# Altium schematic sheet Serial.SchDoc
size A4
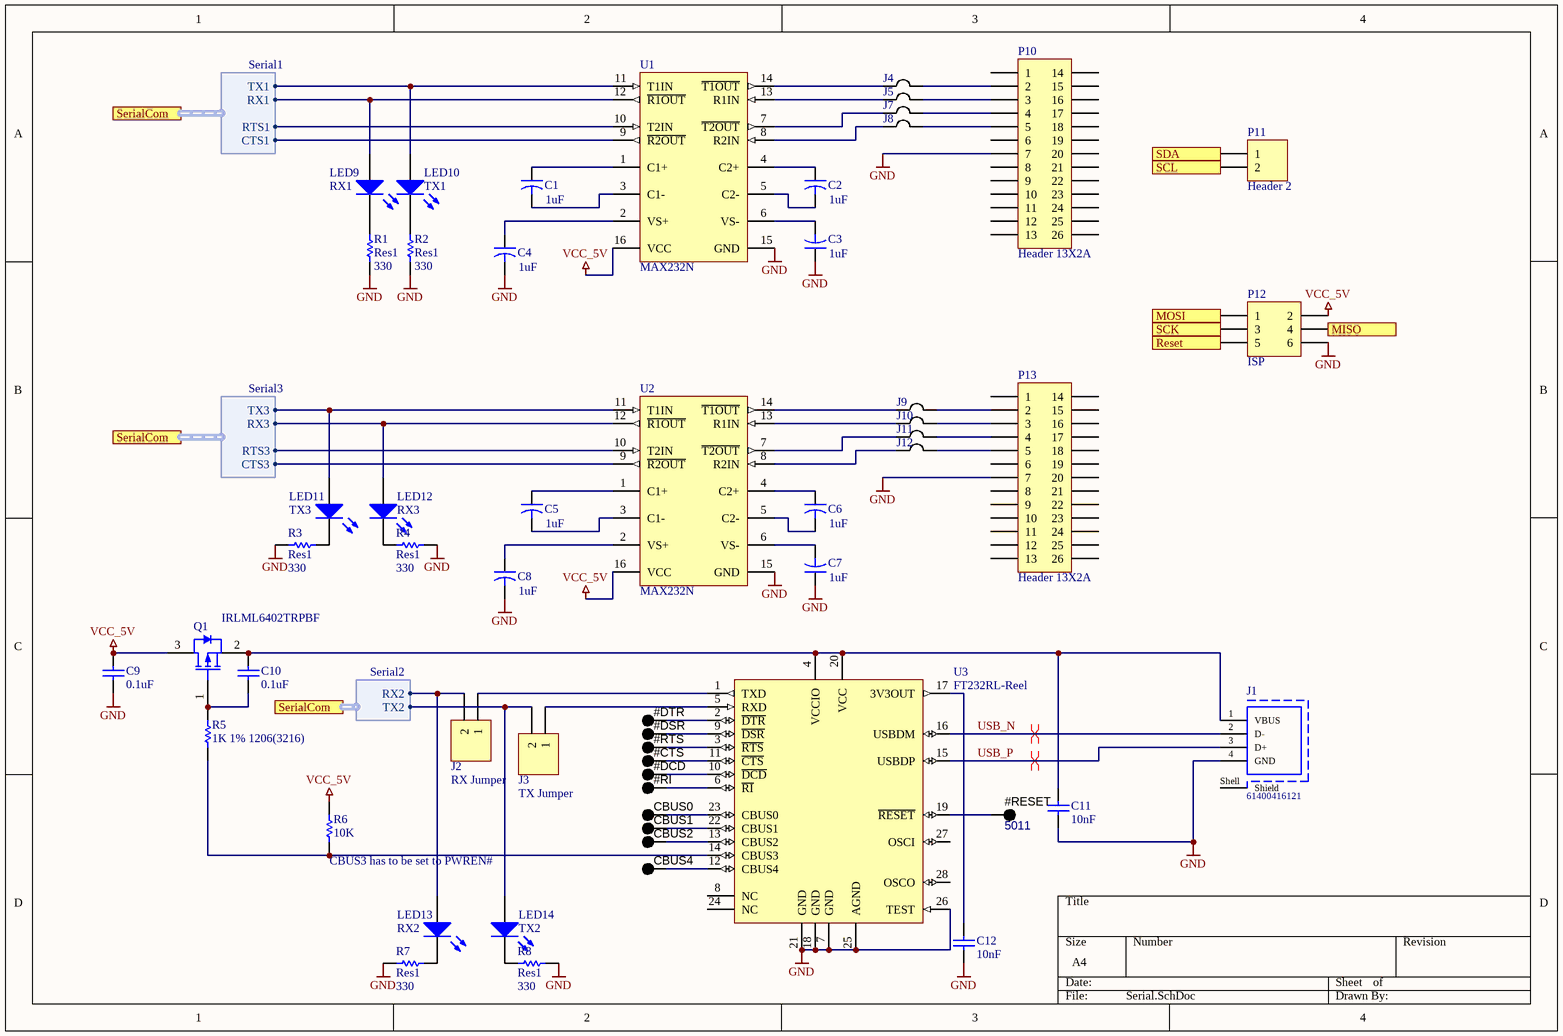
[diagram p0: Serial.SchDoc]

## Parts
#CTS  5011  [KSTN-5011_V]  (value not drawn)
#DCD  5011  [KSTN-5011_V]  (value not drawn)
#DSR  5011  [KSTN-5011_V]  (value not drawn)
#DTR  5011  [KSTN-5011_V]  (value not drawn)
#RESET  5011  [KSTN-5011_V]
#RI  5011  [KSTN-5011_V]  (value not drawn)
#RTS  5011  [KSTN-5011_V]  (value not drawn)
C1  value 1uF  [CAPR5-4X5]  (hidden comment: Cap2)
C2  value 1uF  [CAPR5-4X5]  (hidden comment: Cap2)
C3  value 1uF  [CAPR5-4X5]  (hidden comment: Cap2)
C4  value 1uF  [CAPR5-4X5]  (hidden comment: Cap2)
C5  value 1uF  [CAPR5-4X5]  (hidden comment: Cap2)
C6  value 1uF  [CAPR5-4X5]  (hidden comment: Cap2)
C7  value 1uF  [CAPR5-4X5]  (hidden comment: Cap2)
C8  value 1uF  [CAPR5-4X5]  (hidden comment: Cap2)
C9  0.1uF  [CAPC1206(3216)130_L]
C10  0.1uF  [CAPC1206(3216)130_L]
C11  10nF  [CAPC1206(3216)130_M]
C12  10nF  [CAPC1206(3216)130_M]
CBUS0  5011  [KSTN-5011_V]  (value not drawn)
CBUS1  5011  [KSTN-5011_V]  (value not drawn)
CBUS2  5011  [KSTN-5011_V]  (value not drawn)
CBUS4  5011  [KSTN-5011_V]  (value not drawn)
J1  61400416121  [61400416121]
J2  RX Jumper  [HDR1X2]
J3  TX Jumper  [HDR1X2]
J4  Jumper  [SMDJumper]  (value not drawn)
J5  Jumper  [SMDJumper]  (value not drawn)
J7  Jumper  [SMDJumper]  (value not drawn)
J8  Jumper  [SMDJumper]  (value not drawn)
J9  Jumper  [SMDJumper]  (value not drawn)
J10  Jumper  [SMDJumper]  (value not drawn)
J11  Jumper  [SMDJumper]  (value not drawn)
J12  Jumper  [SMDJumper]  (value not drawn)
LED9  RX1  [Type 3mm]
LED10  TX1  [Type 3mm]
LED11  TX3  [Type 3mm]
LED12  RX3  [Type 3mm]
LED13  RX2  [Type 3mm]
LED14  TX2  [Type 3mm]
P10  Header 13X2A  [HDR2X13_CEN]
P11  Header 2  [HDR1X2]
P12  ISP  [HDR2X3]
P13  Header 13X2A  [HDR2X13_CEN]
Q1  IRLML6402TRPBF  [INTR-SOT-23-3_V]
R1  Res1  value 330  [AXIAL-0.3]
R2  Res1  value 330  [AXIAL-0.3]
R3  Res1  value 330  [AXIAL-0.3]
R4  Res1  value 330  [AXIAL-0.3]
R5  1K 1% 1206(3216)  [RESC1206(3216)_N]
R6  10K  [RESC1206(3216)_M]
R7  Res1  value 330  [AXIAL-0.3]
R8  Res1  value 330  [AXIAL-0.3]
U1  MAX232N  [N0016A]
U2  MAX232N  [N0016A]
U3  FT232RL-Reel  [SSOP-28_M]

## Ports
MISO, MOSI, Reset, SCK, SCL, SDA, SerialCom (harness Serial1), SerialCom (harness Serial2), SerialCom (harness Serial3)

## Harnesses
Serial1: TX1, RX1, CTS1, RTS1
Serial2: TX2, RX2
Serial3: TX3, RX3, CTS3, RTS3

## Nets
GND: C3.1 C4.2 C7.1 C8.2 C9.2 C11.1 C12.1 J1.4(GND) P10.7 P12.6 P13.7 R1.1 R2.1 R3.1 R4.2 R7.1 R8.2 U1.15(GND) U2.15(GND) U3.7(GND) U3.18(GND) U3.21(GND) U3.25(AGND) U3.26(TEST)
VCC_5V: C9.1 P12.2 Q1.3(DRAIN) R6.2 U1.16(VCC) U2.16(VCC)
MISO: P12.4 ; port MISO
MOSI: P12.1 ; port MOSI
Reset: P12.5 ; port Reset
SCK: P12.3 ; port SCK
SCL: P11.2 ; port SCL
SDA: P11.1 ; port SDA
USB_N: J1.2(D-) U3.16(USBDM)
USB_P: J1.3(D+) U3.15(USBDP)
Net#CTS_1: #CTS.1 U3.11(~{CTS})
Net#DCD_1: #DCD.1 U3.10(~{DCD})
Net#DSR_1: #DSR.1 U3.9(~{DSR})
Net#DTR_1: #DTR.1 U3.2(~{DTR})
Net#RESET_1: #RESET.1 U3.19(~{RESET})
Net#RI_1: #RI.1 U3.6(~{RI})
Net#RTS_1: #RTS.1 U3.3(~{RTS})
NetC1_1: C1.1 U1.1(C1+)
NetC1_2: C1.2 U1.3(C1-)
NetC2_1: C2.1 U1.4(C2+)
NetC2_2: C2.2 U1.5(C2-)
NetC3_2: C3.2 U1.6(VS-)
NetC4_1: C4.1 U1.2(VS+)
NetC5_1: C5.1 U2.1(C1+)
NetC5_2: C5.2 U2.3(C1-)
NetC6_1: C6.1 U2.4(C2+)
NetC6_2: C6.2 U2.5(C2-)
NetC7_2: C7.2 U2.6(VS-)
NetC8_1: C8.1 U2.2(VS+)
NetC10_1: C10.1 C11.2 J1.1(VBUS) Q1.2(SOURCE) U3.4(VCCIO) U3.20(VCC)
NetC10_2: C10.2 Q1.1(GATE) R5.2
NetC12_2: C12.2 U3.17(3V3OUT)
NetCBUS0_1: CBUS0.1 U3.23(CBUS0)
NetCBUS1_1: CBUS1.1 U3.22(CBUS1)
NetCBUS2_1: CBUS2.1 U3.13(CBUS2)
NetCBUS4_1: CBUS4.1 U3.12(CBUS4)
NetJ2_1: J2.1 U3.1(TXD)
NetJ2_2: J2.2 LED13.2(A) ; port SerialCom.RX2
NetJ3_1: J3.1 U3.5(RXD)
NetJ3_2: J3.2 LED14.2(A) ; port SerialCom.TX2
NetJ4_1: J4.1 U1.14(~{T1OUT})
NetJ4_2: J4.2 P10.2
NetJ5_1: J5.1 U1.13(R1IN)
NetJ5_2: J5.2 P10.3
NetJ7_1: J7.1 U1.7(~{T2OUT})
NetJ7_2: J7.2 P10.4
NetJ8_1: J8.1 U1.8(R2IN)
NetJ8_2: J8.2 P10.5
NetJ9_1: J9.1 U2.14(~{T1OUT})
NetJ9_2: J9.2 P13.2
NetJ10_1: J10.1 U2.13(R1IN)
NetJ10_2: J10.2 P13.3
NetJ11_1: J11.1 U2.7(~{T2OUT})
NetJ11_2: J11.2 P13.4
NetJ12_1: J12.1 U2.8(R2IN)
NetJ12_2: J12.2 P13.5
NetLED9_1: LED9.1(K) R1.2
NetLED9_2: LED9.2(A) U1.12(~{R1OUT}) ; port SerialCom.RX1
NetLED10_1: LED10.1(K) R2.2
NetLED10_2: LED10.2(A) U1.11(T1IN) ; port SerialCom.TX1
NetLED11_1: LED11.1(K) R3.2
NetLED11_2: LED11.2(A) U2.11(T1IN) ; port SerialCom.TX3
NetLED12_1: LED12.1(K) R4.1
NetLED12_2: LED12.2(A) U2.12(~{R1OUT}) ; port SerialCom.RX3
NetLED13_1: LED13.1(K) R7.2
NetLED14_1: LED14.1(K) R8.1
NetR5_1: R5.1 R6.1 U3.14(CBUS3)
NetU1_9: U1.9(~{R2OUT}) ; port SerialCom.CTS1
NetU1_10: U1.10(T2IN) ; port SerialCom.RTS1
NetU2_9: U2.9(~{R2OUT}) ; port SerialCom.CTS3
NetU2_10: U2.10(T2IN) ; port SerialCom.RTS3

Not connected (* = marked no-connect by the designer): J1 Shell(Shield); P10 1 6 8 9 10 11 12 13 14 15 16 17 18 19 20 21 22 23 24 25 26; P13 1 6 8 9 10 11 12 13 14 15 16 17 18 19 20 21 22 23 24 25 26; U3 8(NC) 24(NC) 27(OSCI) 28(OSCO)

## Layout directives
differential pair; net class USB_N: USB_N
differential pair: USB_P

## Notes on the sheet
- (near R6) CBUS3 has to be set to PWREN#

## Library data of the parts
#CTS #DCD #DSR #DTR #RESET #RI #RTS CBUS0-CBUS2 CBUS4 = CMP-1672-00003-3: Test Point, Black, Through Hole, RoHS, Bulk; Contact Plating: Silver; Packaging: Bulk; Package Quantity: 100; REACH SVHC: No SVHC; PackageDescription: 1-Pin Through Hole Device, Dia 3.17 mm; PackageReference: 5011; Colour: Black; Mount: Through Hole; Mounting Technology: Through Hole; Pins: 1; RoHSCompliant: true; Height: 8.12 mm; Contact Material: Bronze; DatasheetVersion: Rev. F, 12/2013
C1-C8 = Cap2: Capacitor; Published: 23-Sep-2002; PackageReference: CAPR5-4X5; Publisher: Altium Limited; PackageDescription: Capacitor; 2 Leads
C9-C12 = CMP-1037-03460-1: CAP 10nF 16V ±1% 1206 (3216 Metric) Thickness 1.3mm SMD; Case-Metric: 3216; Tolerance: Â±1%; Case-EIA: 1206; Max Thickness: 1.3 mm; Technology: SMT; Rated Voltage: 16 V
  C9 C10: Value: 0.1uF
  C11 C12: Value: 10nF
J1 = CMP-1502-03243-1: USB 2.0 Type B Receptacle WR-COM, Horizontal, THT, with Pads and Pegs; Manufacturer: Wurth Elektronik; Contact Resistance: 20mOhm; Rated Current: 1.5A; Working Voltage: 30VAC; Package Reference: 61400416121; Part Number: 61400416121; Packaging: Tray; Mounting Technology: THT; Gender: Receptacle; Datasheet URL: https://katalog.we-online.de/em/datasheet/61400416121.pdf; Publisher: WurthElektronik; Orientation: Horizontal; Connector Type: USB2.0TypeB; Operating Temperature: -40to105degC; Manufacturer URL: http://www.we-online.de
J2 J3 P11 = Header 2: Header, 2-Pin; LatestRevisionDate: 17-Jul-2002; LatestRevisionNote: Re-released for DXP Platform.; Publisher: Altium Limited
LED9-LED14 = CMP-1489-00003-1: THT LED round mono-color waterclear, WL-TMRW, Yellow; Manufacturer: Wuerth Elektronik; PartNumber: 151033YS03000; ComponentLink2Description: Datasheet; ComponentLink1Description: Manufacturer URL; Emitting color: Yellow; ComponentLink2URL: http://katalog.we-online.de/pbs/datasheet/7448042001.pdfhttp://katalog.we-online.de/pbs/datasheet/7448042001.pdfhttp://katalog.we-online.de/pbs/datasheet/7448042001.pdfhttp://katalog.we-online.de/pbs/datasheet/151033YS03000.pdf; ComponentLink1URL: http://www.we-online.com; PackageReference: Type 3mm
P10 P13 = Header 13X2A: Header, 13-Pin, Dual row; LatestRevisionDate: 17-Jul-2002; LatestRevisionNote: Re-released for DXP Platform.; Publisher: Altium Limited
P12 = Header 3X2: Header, 3-Pin, Dual row; LatestRevisionDate: 17-Jul-2002; LatestRevisionNote: Re-released for DXP Platform.; Publisher: Altium Limited
Q1 = CMP-2000-04987-1: HEXFET(R) Power P-Channel MOSFET, -20 V, -3.7 A, -55 to 150 degC, 3-Pin SOT-23, RoHS, Tape and Reel; Manufacturer: International Rectifier; Drain-to-Source Voltage [Vdss]: 20V; Rated Power Dissipation: 1.3W; Qg Gate Charge: 8nC; Drain-Source On Resistance-Max: 0.065O; Channel Type: P-Channel; Package Reference: SOT-23-3; Manufacturer URL: http://internationalrectifier.com/; Datasheet URL: http://datasheet.octopart.com/IRLML6402TRPBF-International-Rectifier-datasheet-93882.pdf; Datasheet Version: Feb-05; Package Description: 3-Pin Small Outline Transistor, Body 2.92 x 1.3 mm, Pitch 0.95 mm
R1-R4 R7 R8 = Res1: Resistor; Published: 8-Jun-2000; LatestRevisionDate: 17-Jul-2002; LatestRevisionNote: Re-released for DXP Platform.; PackageReference: AXIAL-0.3; Publisher: Altium Limited; PackageDescription: Axial Device, Thru-Hole; 2 Leads; 0.3 in Pin Spacing
R5 = CMP-1014-00510-1: 1K 0.25W 1% 1206 (3216 Metric)  SMD; Case-Metric: 3216; Case-EIA: 1206; Value: 1000.00 Ohm; Power: 0.25 W; Tolerance: 1 %; Technology: SMT
R6 = CMP-1014-00098-1: 10K 0.25W 5% 1206 (3216 Metric)  SMD; Value: 10000.00 Ohm; Case-Metric: 3216; Case-EIA: 1206; Power: 0.25 W; Tolerance: 5 %; Technology: SMT
U1 U2 = CMP-0299-00084-2: Dual EIA-232 Driver / Receiver, 0 to 70 degC, 16-Pin PDIP (N), Pb-Free (RoHS); Single Supply: TRUE; ICC(Max)(mA): 10; SubFamily: RS-232; Supply Voltage(s)(V): 5; ESD HBM(kV): +/-2; Receivers Per Package: 2; ComponentLink1Description: Manufacturer URL; PackageDescription: 16-Pin Plastic Dual-In-Line Package, Row Spacing 7.62 mm, Pitch 2.54 mm; ComponentLink3Description: Package Specification; DatasheetVersion: SLLS047L; ComponentLink2URL: http://www.ti.com/general/docs/lit/getliterature.tsp?genericPartNumber=MAX232&fileType=pdf; RS-232: TRUE; ComponentLink3URL: http://www.ti.com/litv/pdf/mpdi002c; PackageReference: N0016A; PackageVersion: revE, Dec-2002; ComponentLink1URL: www.ti.com; Drivers Per Package: 2; ComponentLink2Description: Datasheet
U3 = CMP-0078-00029-3: USB UART Asynchronous Serial Data Transfer Chip, 28-pin SSOP, Tape and Reel; Manufacturer: FTDI; PackageVersion: Mar-12; PackageReference: SSOP-28; ComponentLink2Description: Datasheet; DatasheetVersion: ver 2.10, Mar-2012; PackageDescription: 28-Pin Small Outline Package 0.65 mm Pitch; ComponentLink1Description: Manufacturer URL; RevisionNote: DatasheetVersion updated to 2.10 Mar-2012; PartNumber: FT232RL-Reel; ComponentLink1URL: http://www.ftdichip.com/; ComponentLink2URL: http://www.ftdichip.com/Support/Documents/DataSheets/ICs/DS_FT232R.pdf